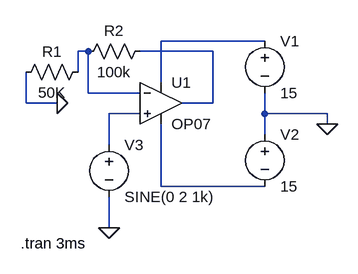
[diagram p0: schematic OP AMP NON INV.asc]
OP AMP NON INV.asc, the LTspice schematic file:
Version 4
SHEET 1 880 680
WIRE 400 48 240 48
WIRE 128 64 112 64
WIRE 320 64 208 64
WIRE 112 96 112 64
WIRE 240 112 240 48
WIRE 128 128 128 64
WIRE 208 128 128 128
WIRE 32 144 32 96
WIRE 80 144 32 144
WIRE 320 144 320 64
WIRE 320 144 272 144
WIRE 208 160 160 160
WIRE 400 160 400 128
WIRE 496 160 400 160
WIRE 496 176 496 160
WIRE 400 192 400 160
WIRE 160 208 160 160
WIRE 240 272 240 176
WIRE 400 272 240 272
WIRE 160 336 160 288
FLAG 496 176 0
FLAG 160 336 0
FLAG 80 144 0
SYMBOL OpAmps\\OP07 240 80 R0
SYMATTR InstName U1
SYMBOL voltage 400 32 R0
WINDOW 123 0 0 Left 0
WINDOW 39 0 0 Left 0
SYMATTR InstName V1
SYMATTR Value 15
SYMBOL voltage 400 176 R0
WINDOW 123 0 0 Left 0
WINDOW 39 0 0 Left 0
SYMATTR InstName V2
SYMATTR Value 15
SYMBOL voltage 160 192 R0
WINDOW 123 0 0 Left 0
WINDOW 39 0 0 Left 0
SYMATTR InstName V3
SYMATTR Value SINE(0 2 1k)
SYMBOL res 128 80 R90
WINDOW 0 0 56 VBottom 2
WINDOW 3 32 56 VTop 2
SYMATTR InstName R1
SYMATTR Value 50K
SYMBOL res 224 48 R90
WINDOW 0 0 56 VBottom 2
WINDOW 3 32 56 VTop 2
SYMATTR InstName R2
SYMATTR Value 100k
TEXT 24 360 Left 2 !.tran 3ms

The netlist it stands for:
* OP AMP NON INV.asc
XU1 N004 N002 N001 N005 N003 LT1001  ; OP07, pins In+ In- V+ V- OUT
V1 N001 0 15
V2 0 N005 15
V3 N004 0 SINE(0 2 1k)
R1 N002 0 50K
R2 N003 N002 100k
.tran 3ms
.lib LTC.lib
.backanno
.end